# Altium schematic sheet LoRa.SchDoc: =title
size A3; DocumentNumber: 6; SheetNumber: 6; SheetTotal: 9
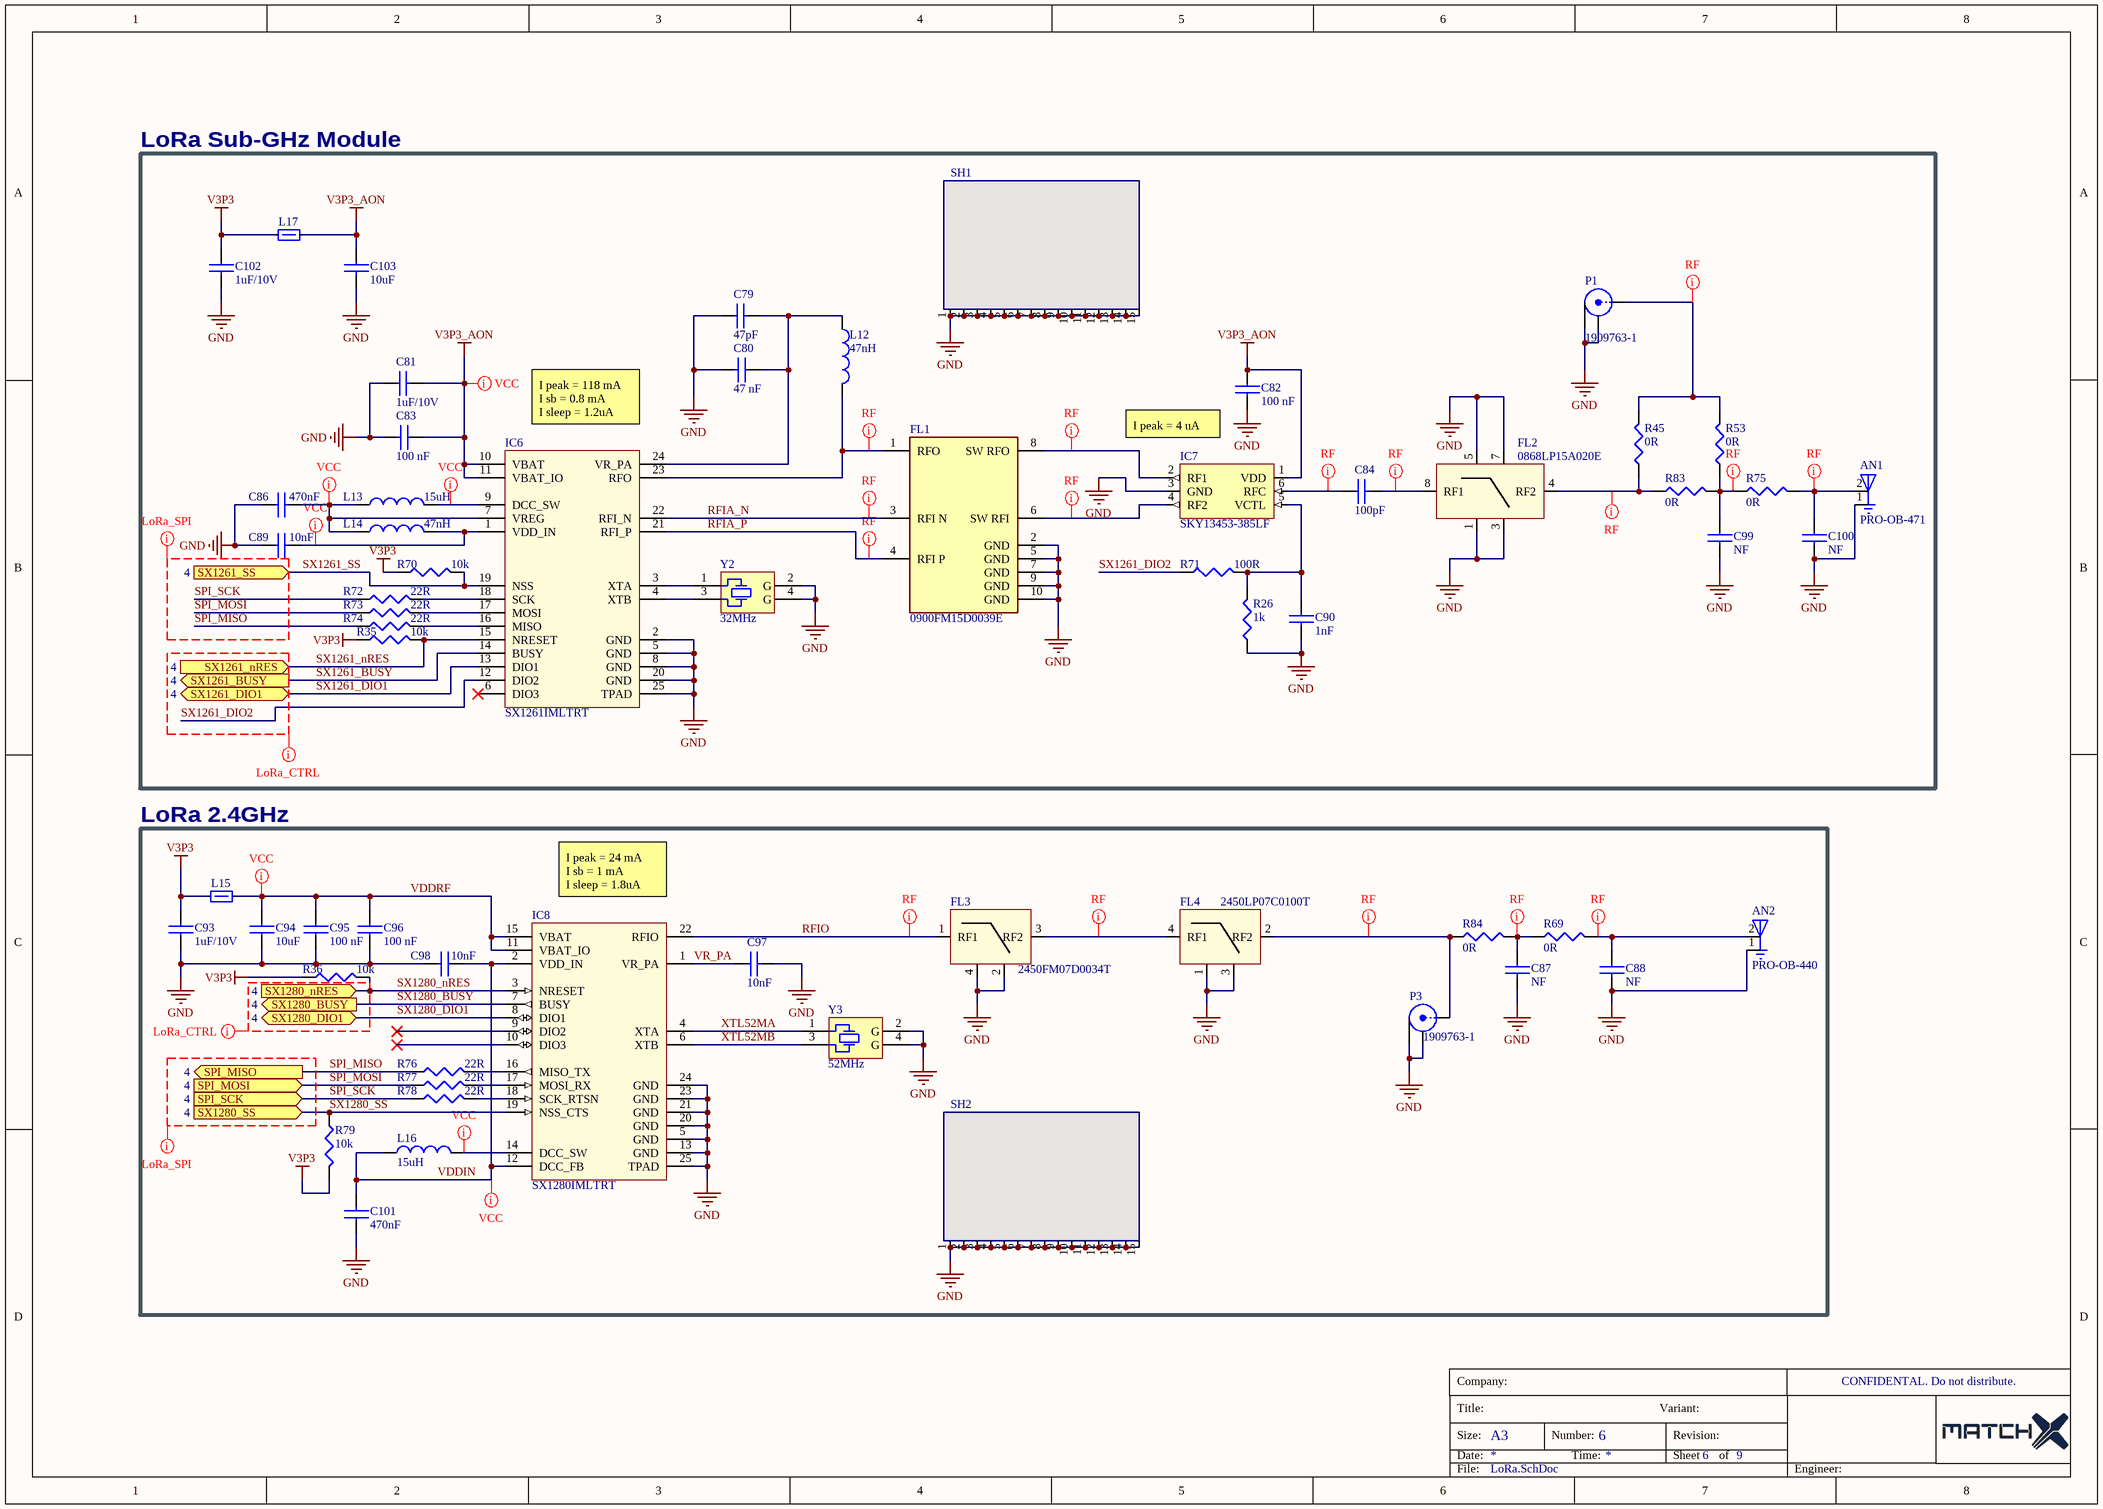
[diagram p0: LoRa.SchDoc]

## Parts
AN1  PRO-OB-471  [XDCR_PRO-OB-471]
AN2  PRO-OB-440  [XDCR_PRO-OB-440]
C79  47pF  [C0402]
C80  47 nF  [C0402]
C81  1uF/10V  [C0402]
C82  100 nF  [C0402]
C83  100 nF  [C0402]
C84  100pF  [C0402]
C86  470nF  [C0402]
C87  NF  [C0402]
C88  NF  [C0402]
C89  10nF  [C0402]
C90  1nF  [C0402]
C93  1uF/10V  [C0402]
C94  10uF  [C0805]
C95  100 nF  [C0402]
C96  100 nF  [C0402]
C97  10nF  [C0402]
C98  10nF  [C0402]
C99  NF  [C0402]
C100  NF  [C0402]
C101  470nF  [C0402]
C102  1uF/10V  [C0402]
C103  10uF  [C0805]
FL1  0900FM15D0039E  [FP-0900FM15D0039E-MFG]
FL2  0868LP15A020E  [LP_FILTER_JOHANSON]
FL3  2450FM07D0034T  [JT=2450FM07D0034T]
FL4  2450LP07C0100T  [JT=2450LP07C0100T]
IC6  SX1261IMLTRT  [QFN50P400X400X80_HS-25N_Semtech]
IC7  SKY13453-385LF  [QFN50P100X100X50-6N]
IC8  SX1280IMLTRT  [QFN50P400X400X80_HS-25N_Semtech]
L12  47nH  [L0402]
L13  15uH  [L0805_ML]
L14  47nH  [L0402]
L15  BLM18KG601SH1D  [L0603]  (value not drawn)
L16  15uH  [L0805_ML]
L17  BLM18KG601SH1D  [L0603]  (value not drawn)
P1  1909763-1  [CON_U.FL]
P3  1909763-1  [CON_U.FL]
R26  1k  [R0402]
R35  10k  [R0402]
R36  10k  [R0402]
R45  0R  [R0402]
R53  0R  [R0402]
R69  0R  [R0402]
R70  10k  [R0402]
R71  100R  [R0402]
R72  22R  [R0402]
R73  22R  [R0402]
R74  22R  [R0402]
R75  0R  [R0402]
R76  22R  [R0402]
R77  22R  [R0402]
R78  22R  [R0402]
R79  10k  [R0402]
R83  0R  [R0402]
R84  0R  [R0402]
SH1  Logo symbol  [SHIELD_MSTICK_SOM]  (value not drawn)
SH2  Logo symbol  [SHIELD_MSTICK_SOM]  (value not drawn)
Y2  32MHz  [nd2016da]
Y3  52MHz  [nd2016da]

## Blocks framed on the sheet
LoRa Sub-GHz Module: AN1 C79-C84 C86 C89 C90 C99 C100 C102 C103 FL1 FL2 IC6 IC7 L12-L14 L17 P1 R26 R35 R45 R53 R70-R75 R83 SH1 Y2
LoRa 2.4GHz: AN2 C87 C88 C93-C98 C101 FL3 FL4 IC8 L15 L16 P3 R36 R69 R76-R79 R84 SH2 Y3

## Ports
SPI_MISO (out, see 4), SPI_MOSI (in, see 4), SPI_SCK (in, see 4), SX1261_BUSY (out, see 4), SX1261_DIO1 (bidir, see 4), SX1261_nRES (in, see 4), SX1261_SS (in, see 4), SX1280_BUSY (out, see 4), SX1280_DIO1 (bidir, see 4), SX1280_nRES (in, see 4), SX1280_SS (in, see 4)

## Nets
GND: AN1.1(GND) AN2.1(GND) C79.1 C80.2 C81.1 C82.2 C83.2 C86.1 C87.2 C88.2 C89.1 C90.2 C93.2 C94.2 C95.2 C96.2 C97.2 C98.2 C99.2 C100.2 C101.1 C102.2 C103.2 FL1.2(GND) FL1.5(GND) FL1.7(GND) FL1.9(GND) FL1.10(GND) FL2.1(GND) FL2.3(GND) FL2.5(GND) FL2.7(GND) FL3.2(GND) FL3.4(GND) FL4.1(GND) FL4.3(GND) IC6.2(GND) IC6.5(GND) IC6.8(GND) IC6.20(GND) IC6.25(TPAD) IC7.3(GND) IC8.5(GND) IC8.13(GND) IC8.20(GND) IC8.21(GND) IC8.23(GND) IC8.24(GND) IC8.25(TPAD) P1.2(Y) P1.3(GND) P3.2(Y) P3.3(GND) R26.1 SH1.1 SH1.2 SH1.3 SH1.4 SH1.5 SH1.6 SH1.7 SH1.8 SH1.9 SH1.10 SH1.11 SH1.12 SH1.13 SH1.14 SH1.15 SH2.1 SH2.2 SH2.3 SH2.4 SH2.5 SH2.6 SH2.7 SH2.8 SH2.9 SH2.10 SH2.11 SH2.12 SH2.13 SH2.14 SH2.15 Y2.2(GND) Y2.4(GND) Y3.2(GND) Y3.4(GND)
V3P3: C93.1 C102.1 L15.1 L17.1 R35.1 R36.1 R70.1 R79.2
V3P3_AON: C81.2 C82.1 C83.1 C103.1 IC6.10(VBAT) IC6.11(VBAT_IO) IC7.1(VDD) L17.2
RFIA_N: FL1.3(RFI_N) IC6.22(RFI_N)
RFIA_P: FL1.4(RFI_P) IC6.21(RFI_P)
RFIO: FL3.1(RF1) IC8.22(RFIO)
SPI_MISO: R74.1 R76.1 ; port SPI_MISO
SPI_MOSI: R73.1 R77.1 ; port SPI_MOSI
SPI_SCK: R72.1 R78.1 ; port SPI_SCK
SX1261_BUSY: IC6.14(BUSY) ; port SX1261_BUSY
SX1261_DIO1: IC6.13(DIO1) ; port SX1261_DIO1
SX1261_DIO2: IC6.12(DIO2) R71.1
SX1261_nRES: IC6.15(NRESET) R35.2 ; port SX1261_nRES
SX1261_SS: IC6.19(NSS) R70.2 ; port SX1261_SS
SX1280_BUSY: IC8.7(BUSY) ; port SX1280_BUSY
SX1280_DIO1: IC8.8(DIO1) ; port SX1280_DIO1
SX1280_nRES: IC8.3(NRESET) R36.2 ; port SX1280_nRES
SX1280_SS: IC8.19(NSS_CTS) R79.1 ; port SX1280_SS
VDDIN: C98.1 C101.2 IC8.2(VDD_IN) IC8.12(DCC_FB) L16.1
VDDRF: C94.1 C95.1 C96.1 IC8.11(VBAT_IO) IC8.15(VBAT) L15.2
VR_PA: C97.1 IC8.1(VR_PA)
XTL52MA: IC8.4(XTA) Y3.1
XTL52MB: IC8.6(XTB) Y3.3
NetAN1_2: AN1.2(RF_FEED) C100.1 R75.2
NetAN2_2: AN2.2(FEED) C88.1 R69.2
NetC79_2: C79.2 C80.1 IC6.24(VR_PA) L12.1
NetC84_1: C84.1 IC7.6(RFC)
NetC84_2: C84.2 FL2.8(RF1)
NetC86_2: C86.2 IC6.7(VREG) L13.1 L14.1
NetC87_1: C87.1 R69.1 R84.2
NetC89_2: C89.2 IC6.1(VDD_IN) L14.2
NetC90_1: C90.1 IC7.5(VCTL) R26.2 R71.2
NetC99_1: C99.1 R53.1 R75.1 R83.2
NetFL1_1: FL1.1(RFO) IC6.23(RFO) L12.2
NetFL1_6: FL1.6(SW_RFI) IC7.4(RF2)
NetFL1_8: FL1.8(SW_RFO) IC7.2(RF1)
NetFL2_4: FL2.4(RF2) R45.1 R83.1
NetFL3_3: FL3.3(RF2) FL4.4(RF1)
NetFL4_2: FL4.2(RF2) P3.1(X) R84.1
NetIC6_3: IC6.3(XTA) Y2.1
NetIC6_4: IC6.4(XTB) Y2.3
NetIC6_9: IC6.9(DCC_SW) L13.2
NetIC6_16: IC6.16(MISO) R74.2
NetIC6_17: IC6.17(MOSI) R73.2
NetIC6_18: IC6.18(SCK) R72.2
NetIC8_14: IC8.14(DCC_SW) L16.2
NetIC8_16: IC8.16(MISO_TX) R76.2
NetIC8_17: IC8.17(MOSI_RX) R77.2
NetIC8_18: IC8.18(SCK_RTSN) R78.2
NetP1_1: P1.1(X) R45.2 R53.2

Not connected (* = marked no-connect by the designer): IC6 6(DIO3)*; IC8 9(DIO2)* 10(DIO3)*

## Layout directives
net class LoRa_SPI; net class LoRa: (no net found under the mark), SPI_MISO, SPI_MOSI, SPI_SCK
net class LoRa_CTRL; net class LoRa: (no net found under the mark), SX1261_DIO2
net class VCC: NetC86_2, NetC89_2, NetIC6_9, NetIC8_14, V3P3_AON, VDDIN, VDDRF
net class RF: NetAN1_2, NetAN2_2, NetC84_1, NetC84_2, NetC87_1, NetC99_1, NetFL1_1, NetFL1_6, NetFL1_8, NetFL2_4, NetFL3_3, NetFL4_2, NetP1_1, RFIA_N, RFIA_P, RFIO

## Notes on the sheet
- (near IC6) I peak = 118 mA
  I sb = 0.8 mA
  I sleep = 1.2uA
  I
- I peak = 4 uA
- (near IC8) I peak = 24 mA
  I sb = 1 mA
  I sleep = 1.8uA
  I
- Company:
- CONFIDENTAL. Do not distribute.
- Title:
- Size:
- Date:
- A3
- Number:
- Time:
- Variant:
- Revision:
- Sheet
- of
- File:
- Engineer:
- (in symbol XTAL_ECS-320-10-37B-CKY) G
- (in symbol XTAL_NX2016SA-52MHZ-EXS00A-CS07103) G

## Library data of the parts
AN1 = ANT_PRO-OB-471: Rf Ant 868MHZ/915MHZ Stamped Met; Manufacturer: Proant; MF: ABRACON; Number of Bands: 2; Return Loss: -6dB; Availability: In Stock; Check_prices: https://www.snapeda.com/parts/PRO-OB-471/Abracon/view-part/?ref=eda; Package: None; Price: None; SnapEDA_Link: https://www.snapeda.com/parts/PRO-OB-471/Abracon/view-part/?ref=snap; Purchase-URL: https://pricing.snapeda.com/search/part/PRO-OB-471/?ref=eda; MP: PRO-OB-471; Value: *; Supplier 1: Digi-Key; Manufacturer Part Number: PRO-OB-471; RoHS: Yes; Mounting Technology: Surface Mount; Packaging: Tape and Reel; Termination: Solder; RoHS Compliant: Yes; ComponentLink1URL: http://www.proant.se/files/user/Datasheet%20-%20OnBoard%20SMD%20868-915%20MHz%20rev%202.0.pdf?src-supplier=Digi-Key; ComponentLink1Description: http://www.proant.se/files/user/Datasheet%20-%20OnBoard%20SMD%20868-915%20MHz%20rev%202.0.pdf?src-supplier=Digi-Key; Supplier Part Number 1: 1532-1004-1-ND
AN2 = ANT_PRO-OB-440: 2.4GHz Bluetooth, WirelessHART, WLAN, Zigbee Stamped Metal RF Antenna 2.4GHz ~ 2.5GHz Solder Surface Mount; Manufacturer: Abracon; MF: Abracon LLC; Package: None; Availability: In Stock; SnapEDA_Link: https://www.snapeda.com/parts/PRO-OB-440/Abracon+LLC/view-part/?ref=snap; MP: PRO-OB-440; Value: *; Purchase-URL: https://pricing.snapeda.com/search/part/PRO-OB-440/?ref=eda; Price: None; Check_prices: https://www.snapeda.com/parts/PRO-OB-440/Abracon+LLC/view-part/?ref=eda; Supplier 1: Digi-Key; Manufacturer Part Number: PRO-OB-440; RoHS: No; Category: RF Antennas; Stock 1: 5150; Pricing 1: 1=0,57000, 10=0,48800, 25=0,45520, 100=0,36400, 250=0,33800, 500=0,28600 (USD); Supplier Part Number 1: 535-PRO-OB-440DKR-ND
C79 = C0402-47pF: CAP, CERM, 47pF, 16V, +/- 5%, C0G/NP0, 0402; Manufacturer Part Number: 885012005029; CompType: Capacitor; Category: Capacitors; Operating Temperature: -55°C ~ 125°C; Package / Case: 0402; RoHS: RoHS Compliant; Temperature Coefficient: C0G/NP0; Tolerance: 5%; Voltage - Rated: 16 V; MountType: SMT; Technology: Ceramic; Value: 47pF
C80 = C0402-47nF: CAP, CERM, 47nF, 16V, +/- 10%, X7R, 0402; Manufacturer Part Number: GCM155R71C473KA37D; CompType: Capacitor; Value: 47 nF; Category: Capacitors; Operating Temperature: -55°C ~ 125°C; Package / Case: 0402; RoHS: RoHS Compliant; Temperature Coefficient: X7R; Tolerance: 10%; Voltage - Rated: 16 V; MountType: SMT; Technology: Ceramic
C81 C93 C102 = C0402-1uF_10V: CAP, CERM, 1 uF, 10V, +/- 10%, X5R, 0402; Manufacturer Part Number: C0402C105M8PACTU; CompType: Capacitor; Value: 1uF/10V; RoHS: RoHS Compliant; MountType: SMT; Technology: Ceramic; Category: Capacitors; Operating Temperature: -55°C ~ 85°C; Package / Case: 0402; Temperature Coefficient: X5R; Tolerance: 10%; Voltage - Rated: 10V
C82 C83 C95 C96 = C0402-100nF_50V: CAP, CERM, 100 nF, 50V, +/- 10%, X7R, 0402; Manufacturer Part Number: GRM155R71H104KE14J; CompType: Capacitor; Value: 100 nF; Category: Capacitors; Operating Temperature: -55°C ~ 125°C; Package / Case: 0402; RoHS: RoHS Compliant; Temperature Coefficient: X7R; Tolerance: 10%; Voltage - Rated: 50 V; MountType: SMT; Technology: Ceramic
C84 = C0402-100pF: CAP, CERM, 100pF, 16V, +/- 5%, C0G/NP0, 0402; Manufacturer Part Number: 885012005031; CompType: Capacitor; Category: Capacitors; Operating Temperature: -55°C ~ 125°C; Package / Case: 0402; RoHS: RoHS Compliant; Temperature Coefficient: C0G/NP0; Tolerance: 5%; Voltage - Rated: 16 V; MountType: SMT; Technology: Ceramic; Value: 100pF
C86 C101 = C0402-470nF: CAP, CERM, 470nF, 16V, +/- 10%, X7R, 0402; Manufacturer Part Number: MSASE105AB5474KFNA01; CompType: Capacitor; Category: Capacitors; Operating Temperature: -55°C ~ 125°C; Package / Case: 0402; RoHS: RoHS Compliant; Temperature Coefficient: X7R; Tolerance: 10%; Voltage - Rated: 16 V; MountType: SMT; Technology: Ceramic; Value: 470nF
C87 C88 C99 C100 = C0402-1.8pF: CAP, CERM, 1.8pF, 50V, +/- 0.1pF, C0G/NP0, 0402; CompType: Capacitor; Category: Capacitors; Operating Temperature: -55°C ~ 125°C; Package / Case: 0402; RoHS: RoHS Compliant; Temperature Coefficient: C0G/NP0; Tolerance: +/- 0.1pF; Voltage - Rated: 50V; MountType: SMT; Technology: Ceramic; Value: NF
C89 C97 C98 = C0402-10nF: CAP, CERM, 10nF, 16V, +/- 10%, X7R, 0402; Manufacturer Part Number: C0402C103J4RAC; CompType: Capacitor; Category: Capacitors; Operating Temperature: -55°C ~ 125°C; Package / Case: 0402; RoHS: RoHS Compliant; Temperature Coefficient: X7R; Tolerance: 10%; Voltage - Rated: 16 V; MountType: SMT; Technology: Ceramic; Value: 10nF
C90 = C0402-1nF: CAP, CERM, 1nF, 16V, +/- 10%, X7R, 0402; Manufacturer Part Number: C0402C102K4RAC; CompType: Capacitor; Category: Capacitors; Operating Temperature: -55°C ~ 125°C; Package / Case: 0402; RoHS: RoHS Compliant; Temperature Coefficient: X7R; Tolerance: 10%; Voltage - Rated: 16 V; MountType: SMT; Technology: Ceramic; Value: 1nF
C94 C103 = C0805-10uF_16V: CAP, CERM, 10uF, 16V, +/- 20%, X5R, 0805; Manufacturer Part Number: GRM21BR61C106KE15L; CompType: Capacitor; Category: Capacitors; Operating Temperature: -55°C ~ 85°C; Package / Case: 0805 (2012 Metric); RoHS: RoHS Compliant; Temperature Coefficient: X5R; Tolerance: 20%; Voltage - Rated: 16 V; MountType: SMT; Technology: Ceramic; Value: 10uF
FL1 = 0900FM15D0039E: Impedance-matched Filter For Sem; Manufacturer: Johanson; Supplier 1: Mouser; RoHS: Yes; Category: EMI / RFI Components; Stock 1: 155361; Pricing 1: 1=0,50000, 10=0,43000, 50=0,43000, 100=0,38800, 1000=0,24900, 10000=0,21000 (USD); Supplier Part Number 1: 609-0900FM15D0039E; Manufacturer Part Number: 0900FM15D0039E
FL2 = LP_0868LP15A020E: RF Filter - Lowpass; Manufacturer: Johanson; Frequency: 868 MHz; Frequency Range: 858 MHz to 878 MHz; Impedance: 50 Ohms; Brand: Johanson Technology; Insertion Loss: 0.5 dB; LatestRevisionDate: 05-oct-2007  -  Semtech; Supplier 1: Digi-Key; Supplier Part Number 1: 712-1585-1-ND; Manufacturer Part Number: 0868LP15A020E; Stock 1: 13811; Pricing 1: 1=0.64, 10=0.614, 25=0.594, 50=0.4852, 100=0.4356, 250=0.396, 500=0.3762, 1000=0.3366 (USD); Product Category: Signal Conditioning; RoHS: Details; Product: Low Pass Filters; Termination Style: SMD/SMT; Package / Case: 0805 (2012 metric); Operating Temperature Range: - 40 C to + 85 C; Packaging: Reel; Factory Pack Quantity: 4000; Type: High Frequency Ceramic; ComponentLink1URL: https://datasheet.ciiva.com/24047/lp-filter-0868lp15a020-258169-24047630.pdf; ComponentLink1Description: https://datasheet.ciiva.com/24047/lp-filter-0868lp15a020-258169-24047630.pdf; ComponentLink2URL: https://datasheet.ciiva.com/7662/1640998-7662948.pdf; ComponentLink2Description: https://datasheet.ciiva.com/7662/1640998-7662948.pdf
FL3 = JT=2450FM07D0034T: Rf Filter 2.4GHZ-2.5GHZ 0402; Manufacturer: Johanson; Frequency: 2.5GHz; Bandwidth: 100MHz; Insertion Loss: 0.75dB; Supplier 1: Digi-Key; Supplier Part Number 1: 712-1654-1-ND; Manufacturer Part Number: 2450FM07D0034T; RoHS: Yes; Stock 1: 116294; Pricing 1: 1=0,28000, 10=0,24400, 25=0,22080, 100=0,19310, 250=0,16944, 500=0,14972, 1000=0,11820 (USD); Mount: Surface Mount; Case Code (Imperial): 0402; Case Code (Metric): 1005; Packaging: Tape and Reel; RoHS Compliant: No; ComponentLink1URL: https://www.johansontechnology.com/datasheets/2450FM07D0034/2450FM07D0034.pdf?src-supplier=Digi-Key; ComponentLink1Description: https://www.johansontechnology.com/datasheets/2450FM07D0034/2450FM07D0034.pdf?src-supplier=Digi-Key
FL4 = JT=2450LP07C0100T: Rf Filter Low Pass 2.4GHZ 0402; Manufacturer: Johanson; Supplier 1: Digi-Key; Manufacturer Part Number: 2450LP07C0100T; RoHS: No; Stock 1: 17511; Pricing 1: 1=0,29000, 10=0,26900, 25=0,25640, 50=0,24800, 100=0,23980, 250=0,22736, 500=0,19016, 1000=0,14758, 5000=0,13229 (USD); Supplier Part Number 1: 712-2450LP07C0100TCT-ND
IC6 = SX1261IMLTRT: IC RF TxRx Only General ISM < 1GHz LoRaWAN 150MHz ~ 960MHz 24-VFQFN Exposed Pad; Manufacturer: Semtech; Supplier 1: Digi-Key; Supplier Part Number 1: SX1261IMLTRTCT-ND; Manufacturer Part Number: SX1261IMLTRT; Stock 1: 1035; Pricing 1: 1 = 7,53000, 10 = 6,90700, 25 = 6,27920, 100 = 5,65110, 250 = 5,18016, 500 = 4,70926, 1000 = 4,23833 (USD); RoHS: No; ComponentLink1URL: https://www.semtech.com/uploads/documents/DS_SX1261-2_V1.1.pdf?src-supplier=Digi-Key; ComponentLink1Description: https://www.semtech.com/uploads/documents/DS_SX1261-2_V1.1.pdf?src-supplier=Digi-Key
IC7 = SKY13453-385LF: RF Switch IC WLAN 6GHz 50 Ohm 6-QFN (1x1); Manufacturer: Skyworks Solutions; P1dB: 33dBm; Impedance: 50R; Max Frequency: 600MHz; IIP3: 57dBm; Operating Supply Voltage: 3.5V; Supplier 1: Digi-Key; Supplier Part Number 1: 863-1602-1-ND; Manufacturer Part Number: SKY13453-385LF; Stock 1: 46443; Pricing 1: 1 = 0,63000, 10 = 0,55700, 100 = 0,42740, 500 = 0,33784, 1000 = 0,27027 (USD); RoHS: Yes; Mount: Surface Mount; Case/Package: QFN; Number of Pins: 6; Min Operating Temperature: -30°C; Max Operating Temperature: 90°C; Packaging: Tape and Reel; ComponentLink1URL: http://www.mouser.com/ds/2/472/SKY13453_385LF_202830B-437415.pdf?src-supplier=Mouser; ComponentLink1Description: http://www.mouser.com/ds/2/472/SKY13453_385LF_202830B-437415.pdf?src-supplier=Mouser; ComponentLink2URL: http://www.skyworksinc.com/uploads/documents/SKY13453_385LF_202830C.pdf?src-supplier=Avnet+Asia; ComponentLink2Description: http://www.skyworksinc.com/uploads/documents/SKY13453_385LF_202830C.pdf?src-supplier=Avnet+Asia; ComponentLink3URL: http://www.skyworksinc.com/uploads/documents/SKY13453_385LF_202830E.pdf?src-supplier=Digi-Key; ComponentLink3Description: http://www.skyworksinc.com/uploads/documents/SKY13453_385LF_202830E.pdf?src-supplier=Digi-Key; ComponentLink4URL: http://www.skyworksinc.com/uploads/documents/SKY13453_385LF_202830C.pdf?src-supplier=Avnet; ComponentLink4Description: http://www.skyworksinc.com/uploads/documents/SKY13453_385LF_202830C.pdf?src-supplier=Avnet
IC8 = SX1280IMLTRT: IC RF TxRx Only 802.15.4 LoRa™ 2.4GHz 24-WFQFN Exposed Pad; Manufacturer: Semtech; Supplier 1: Digi-Key; Supplier Part Number 1: SX1280IMLTRTCT-ND; Manufacturer Part Number: SX1280IMLTRT; Stock 1: 1571; Pricing 1: 1=6,93000, 10=6,35300, 25=5,77520, 100=5,19750, 250=4,76436, 500=4,33126, 1000=3,89813 (USD); RoHS: No; ComponentLink1URL: https://www.semtech.com/uploads/documents/DS_SX1280-1_V2.2.pdf?src-supplier=Digi-Key; ComponentLink1Description: https://www.semtech.com/uploads/documents/DS_SX1280-1_V2.2.pdf?src-supplier=Digi-Key
L12 = LQW15AN47NJ00D: Inductor, Wirewound, 47nH, 210 mA, 1.08Ohms, ±0.2nH, SMD; Manufacturer: Murata; Tolerance: 5%; Current Rating: 210mA; Shielding: Unshielded; DC Resistance (DCR): 1.08R; Core Material: Air; Q Factor: 25; Self Resonant Frequency: 2.9GHz; Test Frequency: 100MHz; Value: 47nH; Supplier 1: Digi-Key; Manufacturer Part Number: LQW15AN47NJ00D; Stock 1: 62730; Pricing 1: 1 = 0,17000, 10 = 0,15500, 100 = 0,10350, 500 = 0,08626, 1000 = 0,07245, 2500 = 0,06210 (USD); Packaging: Tape and Reel; Inductance: 47nH; ComponentLink1URL: https://datasheet.ciiva.com/11799/0900766b8090d800-11799049.pdf?src-supplier=RSComponents; ComponentLink1Description: https://datasheet.ciiva.com/11799/0900766b8090d800-11799049.pdf?src-supplier=RSComponents; ComponentLink2URL: https://datasheet.ciiva.com/1042/l0075s0080lqw15a-00-1042160.pdf?src-supplier=Digi-Key; ComponentLink2Description: https://datasheet.ciiva.com/1042/l0075s0080lqw15a-00-1042160.pdf?src-supplier=Digi-Key; ComponentLink3URL: https://datasheet.ciiva.com/1042/l0075s0080lqw15a-00-1042161.pdf?src-supplier=Digi-Key; ComponentLink3Description: https://datasheet.ciiva.com/1042/l0075s0080lqw15a-00-1042161.pdf?src-supplier=Digi-Key; ComponentLink4URL: https://datasheet.ciiva.com/8506/l0075s0080lqw15a-00-8506009.pdf?src-supplier=Avnet; ComponentLink4Description: https://datasheet.ciiva.com/8506/l0075s0080lqw15a-00-8506009.pdf?src-supplier=Avnet; ComponentLink5URL: https://datasheet.ciiva.com/17247/l0075s0080lqw15a-00-17247726.pdf?src-supplier=Avnet+Europe; ComponentLink5Description: https://datasheet.ciiva.com/17247/l0075s0080lqw15a-00-17247726.pdf?src-supplier=Avnet+Europe; ComponentLink6URL: https://datasheet.ciiva.com/1042/l0075s0080lqw15a-00-1042159.pdf?src-supplier=Digi-Key; ComponentLink6Description: https://datasheet.ciiva.com/1042/l0075s0080lqw15a-00-1042159.pdf?src-supplier=Digi-Key; Supplier Part Number 1: 490-1154-1-ND; RoHS: Yes; Mount: Surface Mount; Case/Package: 0402; Weight: 2.8E-05oz; Case Code (Metric): 1005; Case Code (Imperial): 0402; Min Operating Temperature: -55°C; Max Operating Temperature: 125°C; Max DC Current: 210mA; Package Quantity: 1; Termination: SMD/SMT; Composition: Wirewound; DC Current: 210mA; Military Standard: Not; Length: 1mm; Height: 0.5mm; Width: 0.02inch; Depth: 0.6mm; Radiation Hardening: No; Lead Free: Lead Free
L13 = L_LQM21DN150M70L: Inductor, 15Uh, 0.25A, Multilayer Rohs Compliant: Yes; Manufacturer: Murata; Supplier 1: Digi-Key; Supplier Part Number 1: 490-LQM21DN150M70LCT-ND; Manufacturer Part Number: LQM21DN150M70L; Stock 1: 2488; Pricing 1: 1=0,26000, 10=0,23700, 25=0,21040, 50=0,17880, 100=0,15770, 250=0,14460, 500=0,13144, 1000=0,11042 (USD); RoHS: Yes; Value: 15uH; Category: Fixed Inductors
L14 = LQW15AN47NJ00D: Inductor, Wirewound, 47nH, 210 mA, 1.08Ohms, ±0.2nH, SMD; Manufacturer: Murata; Core Material: Air; Tolerance: 5%; DC Resistance (DCR): 1.08R; Max DC Current: 210mA; Shielding: Unshielded; Q Factor: 25; Self Resonant Frequency: 2.9GHz; Test Frequency: 100MHz; Value: 47nH; Supplier 1: Digi-Key; Supplier Part Number 1: 490-1154-1-ND; Manufacturer Part Number: LQW15AN47NJ00D; Stock 1: 62730; Pricing 1: 1 = 0,17000, 10 = 0,15500, 100 = 0,10350, 500 = 0,08626, 1000 = 0,07245, 2500 = 0,06210 (USD); RoHS: Yes; Mount: Surface Mount; Case/Package: 0402; Weight: 2.8E-05oz; Case Code (Metric): 1005; Case Code (Imperial): 0402; Min Operating Temperature: -55°C; Max Operating Temperature: 125°C; Inductance: 47nH; Package Quantity: 1; Current Rating: 210mA; Packaging: Tape and Reel; Termination: SMD/SMT; Composition: Wirewound; DC Current: 210mA; Military Standard: Not; Length: 1mm; Height: 0.5mm; Width: 0.02inch; Depth: 0.6mm; Radiation Hardening: No; Lead Free: Lead Free; ComponentLink1URL: https://datasheet.ciiva.com/11799/0900766b8090d800-11799049.pdf?src-supplier=RSComponents; ComponentLink1Description: https://datasheet.ciiva.com/11799/0900766b8090d800-11799049.pdf?src-supplier=RSComponents; ComponentLink2URL: https://datasheet.ciiva.com/1042/l0075s0080lqw15a-00-1042160.pdf?src-supplier=Digi-Key; ComponentLink2Description: https://datasheet.ciiva.com/1042/l0075s0080lqw15a-00-1042160.pdf?src-supplier=Digi-Key; ComponentLink3URL: https://datasheet.ciiva.com/1042/l0075s0080lqw15a-00-1042161.pdf?src-supplier=Digi-Key; ComponentLink3Description: https://datasheet.ciiva.com/1042/l0075s0080lqw15a-00-1042161.pdf?src-supplier=Digi-Key; ComponentLink4URL: https://datasheet.ciiva.com/8506/l0075s0080lqw15a-00-8506009.pdf?src-supplier=Avnet; ComponentLink4Description: https://datasheet.ciiva.com/8506/l0075s0080lqw15a-00-8506009.pdf?src-supplier=Avnet; ComponentLink5URL: https://datasheet.ciiva.com/17247/l0075s0080lqw15a-00-17247726.pdf?src-supplier=Avnet+Europe; ComponentLink5Description: https://datasheet.ciiva.com/17247/l0075s0080lqw15a-00-17247726.pdf?src-supplier=Avnet+Europe; ComponentLink6URL: https://datasheet.ciiva.com/1042/l0075s0080lqw15a-00-1042159.pdf?src-supplier=Digi-Key; ComponentLink6Description: https://datasheet.ciiva.com/1042/l0075s0080lqw15a-00-1042159.pdf?src-supplier=Digi-Key
L15 L17 = BLM18KG601SH1D: Ferrite Beads 0603 600ohms 1.3A DCR=.15ohms; Manufacturer: Murata Electronics North America; Filter Type: Power Line; Number of Lines: 1; Impedance @ Frequency: 600 Ohm @ 100MHz; DC Resistance (DCR) (Max): 150 mOhm; Supplier 1: Digi-Key; Manufacturer Part Number: BLM18KG601SH1D; RoHS: RoHS Compliant; Category: Filters; Stock 1: 5830; Pricing 1: 1=0.11, 10=0.088, 50=0.058, 100=0.0502, 250=0.0396, 500=0.03344, 1000=0.02816 (USD); Packaging: Cut Tape (CT); Current Rating (Max): 1.3A; Ratings: AEC-Q200; Operating Temperature: -55°C ~ 125°C; Package / Case: 0603 (1608 Metric); Mounting Type: Surface Mount; Height (Max): 0.037" (0.95mm); Size / Dimension: 0.063" L x 0.032" W (1.60mm x 0.80mm); ComponentLink1URL: http://www.murata.com/en-global/products/productdata/8796737273886/QNFA9101.pdf; ComponentLink1Description: http://www.murata.com/en-global/products/productdata/8796737273886/QNFA9101.pdf; Supplier Part Number 1: 490-13259-1-ND
L16 = L_MLZ2012M150WTD25: Chip inductor, 15uH, 250mA, 950mOhm, 0805; Manufacturer: TDK; Core Material: Ferrite; Tolerance: 20%; Saturation Current: 120mA; Shielding: Shielded; DC Resistance (DCR): 1.235R; Test Frequency: 2MHz; Supplier 1: Digi-Key; Supplier Part Number 1: 445-17074-1-ND; Manufacturer Part Number: MLZ2012M150WTD25; Stock 1: 1570; Pricing 1: 1 = 0,19000, 10 = 0,16800, 100 = 0,11210, 500 = 0,09346, 1000 = 0,07850 (USD); RoHS: Yes; Mount: Surface Mount; Case/Package: 0805; Weight: 0.000194oz; Case Code (Metric): 2012; Case Code (Imperial): 0805; Min Operating Temperature: -55°C; Max Operating Temperature: 125°C; Package Quantity: 2000; Packaging: Tape and Reel; Current Rating: 250mA; Inductance: 15uH; Termination: SMD/SMT; Max DC Current: 250mA; Length: 0.079inch; Height: 1.25mm; Width: 0.049inch; Height - Seated (Max): 0.057inch; Ratings: AEC-Q200; ComponentLink1URL: http://www.mouser.com/ds/2/400/nductor_commercial_decoupling_mlz2012_en-918301.pdf?src-supplier=Mouser; ComponentLink1Description: http://www.mouser.com/ds/2/400/nductor_commercial_decoupling_mlz2012_en-918301.pdf?src-supplier=Mouser; ComponentLink2URL: http://product.tdk.com/inductor/ind/en/documents/inductor_automotive_decoupling_mlz_en.pdf?src-supplier=Digi-Key; ComponentLink2Description: http://product.tdk.com/inductor/ind/en/documents/inductor_automotive_decoupling_mlz_en.pdf?src-supplier=Digi-Key; ComponentLink3URL: https://product.tdk.com/info/en/catalog/datasheets/inductor_automotive_decoupling_mlz2012_en.pdf?src-supplier=Digi-Key; ComponentLink3Description: https://product.tdk.com/info/en/catalog/datasheets/inductor_automotive_decoupling_mlz2012_en.pdf?src-supplier=Digi-Key; Value: 15uH
P1 = CON_U.FL: CONN UMCC JACK STR 50OHM SMD; Manufacturer: TE Connectivity AMP Connectors; Connector Style: Ultra Miniature Coaxial; Connector Type: Jack, Male Pin; Contact Termination: Solder; Frequency - Max: 6GHz; Includes: 1 pc - 1 Connector; Body Material: Copper Alloy; Body Finish: Gold; Dielectric Material: Liquid Crystal Polymer (LCP); Voltage Rating: 60V; Mating Cycles: 30; Insertion Loss: 0.24dB; Supplier 1: Digi-Key; Manufacturer Part Number: 1909763-1; RoHS: RoHS Compliant; Category: Connectors, Interconnects; Stock 1: 68653; Pricing 1: 1=0.54, 10=0.508, 25=0.4572, 50=0.4066, 100=0.3896, 250=0.35576, 500=0.3388, 1000=0.27951, 2500=0.2541 (USD); Packaging: Cut Tape (CT); Part Status: Active; Shield Termination: Solder; Impedance: 50 Ohm; Mounting Type: Surface Mount; Mounting Feature: -; Cable Group: -; Fastening Type: Snap-On; Features: -; Housing Color: Ivory; Ingress Protection: -; Center Contact Plating: Gold; Operating Temperature: -40°C ~ 90°C; Center Contact Material: Copper Alloy; ComponentLink1URL: http://www.te.com/commerce/DocumentDelivery/DDEController?Action=srchrtrv&DocNm=1909763&DocType=Customer+Drawing&DocLang=English; ComponentLink1Description: http://www.te.com/commerce/DocumentDelivery/DDEController?Action=srchrtrv&DocNm=1909763&DocType=Customer+Drawing&DocLang=English; Supplier Part Number 1: A118077CT-ND
P3 = CON_U.FL: CONN UMCC JACK STR 50OHM SMD; Manufacturer: TE Connectivity AMP Connectors; Connector Style: Ultra Miniature Coaxial; Connector Type: Jack, Male Pin; Contact Termination: Solder; Frequency - Max: 6GHz; Includes: 1 pc - 1 Connector; Body Material: Copper Alloy; Body Finish: Gold; Dielectric Material: Liquid Crystal Polymer (LCP); Voltage Rating: 60V; Mating Cycles: 30; Insertion Loss: 0.24dB; .Checked PCB: OK M; Supplier 1: Digi-Key; Manufacturer Part Number: 1909763-1; RoHS: RoHS Compliant; Category: Connectors, Interconnects; Stock 1: 68653; Pricing 1: 1=0.54, 10=0.508, 25=0.4572, 50=0.4066, 100=0.3896, 250=0.35576, 500=0.3388, 1000=0.27951, 2500=0.2541 (USD); Packaging: Cut Tape (CT); Part Status: Active; Shield Termination: Solder; Impedance: 50 Ohm; Mounting Type: Surface Mount; Mounting Feature: -; Cable Group: -; Fastening Type: Snap-On; Features: -; Housing Color: Ivory; Ingress Protection: -; Center Contact Plating: Gold; Operating Temperature: -40°C ~ 90°C; Center Contact Material: Copper Alloy; ComponentLink1URL: http://www.te.com/commerce/DocumentDelivery/DDEController?Action=srchrtrv&DocNm=1909763&DocType=Customer+Drawing&DocLang=English; ComponentLink1Description: http://www.te.com/commerce/DocumentDelivery/DDEController?Action=srchrtrv&DocNm=1909763&DocType=Customer+Drawing&DocLang=English; Supplier Part Number 1: A118077CT-ND; .Checked SCH: OK M
R26 = R0402-1k: RES, 1k, 1%, 1/16 W, 0402; Power (Watts): 0.063W, 1/16W; .Checked PCB: OK RF; .Checked SCH: RF; Category: Resistors; Package / Case: 0402; Tolerance: ±1%; Value: 1k; RoHS: RoHS Compliant; Composition: Thick Film; Features: -; Size / Dimension: 0.039" L x 0.020" W (1.00mm x 0.50mm); Height: 0.016" (0.40mm); Number of Terminations: 2
R35 R36 R70 R79 = R0402-10k: RES, 10k, 1%, 1/16 W, 0402; Manufacturer Part Number: RE0402FRE0710KL; Power (Watts): 0.063W, 1/16W; .Checked PCB: OK RF; .Checked SCH: RF; Category: Resistors; Package / Case: 0402; Tolerance: ±1%; Value: 10k; RoHS: RoHS Compliant; Composition: Thick Film; Features: -; Size / Dimension: 0.039" L x 0.020" W (1.00mm x 0.50mm); Height: 0.016" (0.40mm); Number of Terminations: 2
R45 R53 R69 R75 R83 R84 = R0402-0R: RES, 0R, 1%, 1/16 W, 0402; Manufacturer Part Number: AC0402FR-070RL; Power (Watts): 0.063W, 1/16W; .Checked PCB: OK RF; .Checked SCH: RF; Category: Resistors; Package / Case: 0402; Tolerance: ±1%; Value: 0R; RoHS: RoHS Compliant; Composition: Thick Film; Features: -; Size / Dimension: 0.039" L x 0.020" W (1.00mm x 0.50mm); Height: 0.016" (0.40mm); Number of Terminations: 2
R71 = R0402-100R: RES, 100R, 1%, 1/16 W, 0402; Manufacturer Part Number: RC0402FR-13100RL; Power (Watts): 0.063W, 1/16W; .Checked PCB: OK RF; .Checked SCH: RF; Category: Resistors; Package / Case: 0402; Tolerance: ±1%; Value: 100R; RoHS: RoHS Compliant; Composition: Thick Film; Features: -; Size / Dimension: 0.039" L x 0.020" W (1.00mm x 0.50mm); Height: 0.016" (0.40mm); Number of Terminations: 2
R72-R74 R76-R78 = R0402-22R: RES, 22R, 1%, 1/16 W, 0402; Manufacturer Part Number: RC0402FR-0722RP; Power (Watts): 0.063W, 1/16W; .Checked PCB: OK RF; .Checked SCH: RF; Category: Resistors; Package / Case: 0402; Tolerance: ±1%; Value: 22R; RoHS: RoHS Compliant; Composition: Thick Film; Features: -; Size / Dimension: 0.039" L x 0.020" W (1.00mm x 0.50mm); Height: 0.016" (0.40mm); Number of Terminations: 2
SH1 SH2 = Shield_MStick_SOM: Shield - EMI Gasket - Standard Surface Mount Shields 14.9x18.5x2mm; Package / Case: 14.9x18.5x2mm
Y2 = XTAL_ECS-320-10-37B-CKY: 32MHz ±10ppm Crystal 10pF 50 Ohms 4-SMD 2016, No Lead; Manufacturer: ECS International; Supplier 1: Digikey; Supplier Part Number 1: XC3068DKR-ND; Stock 1: 1000; Pricing 1: 1=0.5, 10=0.415, 50=0.3738, 100=0.3322, 500=0.3156 (USD); Manufacturer Part Number: ECS-320-10-37B-CKY; Value: 32MHz
Y3 = XTAL_NX2016SA-52MHZ-EXS00A-CS07103: 52 MHz Crystal 10pF 50 Ohms 4-SMD, No Lead; Manufacturer: ECS; Manufacturer Part Number: ECS-520-12-37B-CTN-TR; ESR (Equivalent Series Resistance): 50R; Supplier 1: Digi-Key; Supplier Part Number 1: 644-1381-1-ND; RoHS: No; Stock 1: 59845; Pricing 1: 1=0,79000, 10=0,69700, 50=0,65140, 100=0,57570, 500=0,54540, 1000=0,45450 (USD); Mount: Surface Mount; Case/Package: SMD/SMT; Min Operating Temperature: -40°C; Max Operating Temperature: 125°C; Packaging: Tape and Reel; Frequency: 52MHz; Load Capacitance: 10pF; Ratings: AEC-Q200; Value: 52MHz